# Altium schematic sheet LVDS.SchDoc
size A4
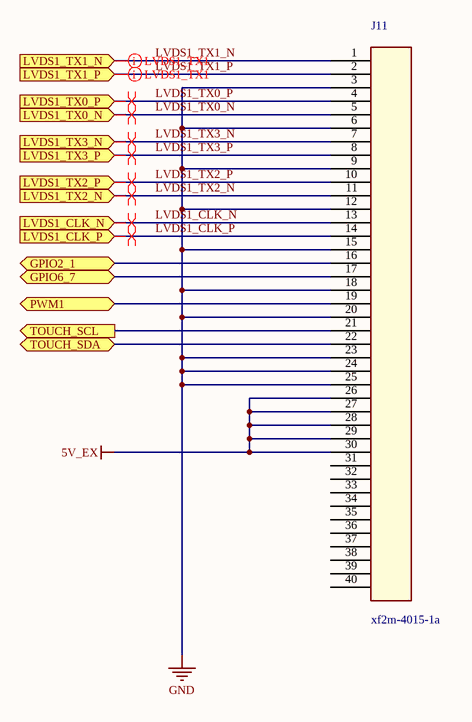
[diagram p0: LVDS.SchDoc]

## Parts
J11  xf2m-4015-1a  [FPC40-0P5-OMRON]

## Ports
GPIO2_1 (bidir), GPIO6_7 (bidir), LVDS1_CLK_N (in), LVDS1_CLK_P (in), LVDS1_TX0_N (in), LVDS1_TX0_P (in), LVDS1_TX1_N (in), LVDS1_TX1_P (in), LVDS1_TX2_N (in), LVDS1_TX2_P (in), LVDS1_TX3_N (in), LVDS1_TX3_P (in), PWM1 (bidir), TOUCH_SCL (out), TOUCH_SDA (bidir)

## Nets
5V_EX: J11.26 J11.27 J11.28 J11.29 J11.30
GND: J11.3 J11.6 J11.9 J11.12 J11.15 J11.18 J11.20 J11.23 J11.24 J11.25
GPIO2_1: J11.16 ; port GPIO2_1
GPIO6_7: J11.17 ; port GPIO6_7
LVDS1_CLK_N: J11.13 ; port LVDS1_CLK_N
LVDS1_CLK_P: J11.14 ; port LVDS1_CLK_P
LVDS1_TX0_N: J11.5 ; port LVDS1_TX0_N
LVDS1_TX0_P: J11.4 ; port LVDS1_TX0_P
LVDS1_TX1_N: J11.1 ; port LVDS1_TX1_N
LVDS1_TX1_P: J11.2 ; port LVDS1_TX1_P
LVDS1_TX2_N: J11.11 ; port LVDS1_TX2_N
LVDS1_TX2_P: J11.10 ; port LVDS1_TX2_P
LVDS1_TX3_N: J11.7 ; port LVDS1_TX3_N
LVDS1_TX3_P: J11.8 ; port LVDS1_TX3_P
PWM1: J11.19 ; port PWM1
TOUCH_SCL: J11.21 ; port TOUCH_SCL
TOUCH_SDA: J11.22 ; port TOUCH_SDA

Not connected (* = marked no-connect by the designer): J11 31 32 33 34 35 36 37 38 39 40

## Layout directives
differential pair: LVDS1_CLK_N, LVDS1_CLK_P, LVDS1_TX0_N, LVDS1_TX0_P, LVDS1_TX1_N, LVDS1_TX1_P, LVDS1_TX2_N, LVDS1_TX2_P, LVDS1_TX3_N, LVDS1_TX3_P

## Library data of the parts
J11 = CON40